# EAGLE design ButtonHack (EAGLE 9.4.2)
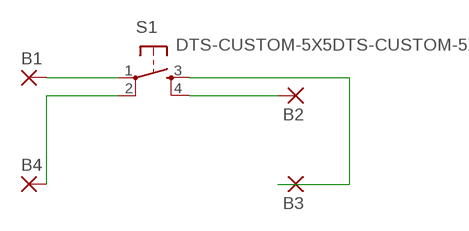
[diagram p0: schematic, sheet 1]

## Parts
B1  2,54/0,8  [2,54/0,8]
B2  2,54/0,8  [2,54/0,8]
B3  2,54/0,8  [2,54/0,8]
B4  2,54/0,8  [2,54/0,8]
S1  DTS-CUSTOM-5X5DTS-CUSTOM-5X5  [DTS-CUSTOM-5X5]

## Nets
N$1: B1.1(P) S1.1
N$2: B2.1(P) S1.4
N$3: B4.1(P) S1.2
N$4: B3.1(P) S1.3

## Library data of the parts
B1-B4 = wirepad:2,54/0,8: THROUGH-HOLE PAD
S1 = switch-tact:DTS-CUSTOM-5X5

## Net classes
0 default: width 0.762 mm, drill 0.762 mm, clearance 0.635 mm
1 Profile: width 0.254 mm, drill 0.254 mm, clearance 0.127 mm

## Board
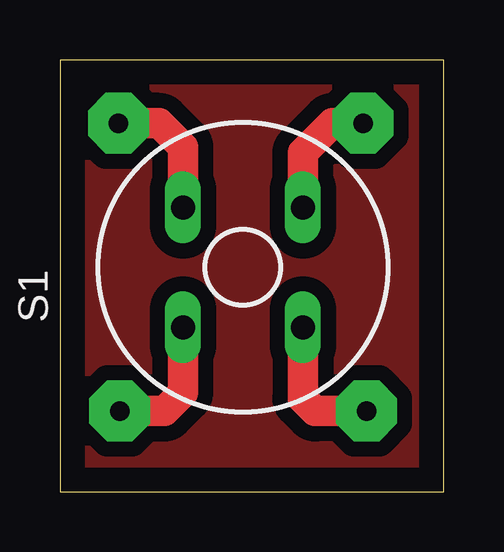
[diagram p1: board, top side]
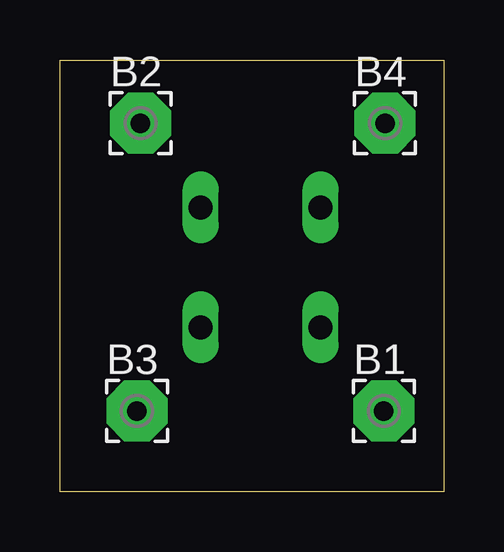
[diagram p2: board, bottom side, seen from below]

Size 16 x 18 mm. Coordinates in mm from the lower left corner, seen from the top.
Outline: 0,0 16,0 16,18 0,18 0,0
Copper layers (1*16): Top 0.035mm / dielectric 1.5mm / Bottom 0.035mm
Design rules "default": minimum track width 6mil, minimum drill 0.35mm, track to track 6mil, track to pad 6mil, pad to pad 6mil, via to via 6mil, smd to smd 6mil, copper to edge 40mil, drill to drill 6mil, minimum pad ring 10mil, minimum via ring 8mil, stop-mask expansion 4mil, vias tented up to drill 0mil, thermal gap 10mil

### Footprints (pad centres in the part's own frame; a part is rotated, then mirrored left to right if it is on the bottom)
2,54/0,8 = drill 0.813 pad 2.54 octagon: 1 0,0
DTS-CUSTOM-5X5 = drill 1 long: 1 -2.31,2.69; 2 2.69,2.69; 3 -2.31,-2.31; 4 2.69,-2.31

### Placement (x,y rotation side)
B1  2.49,3.36 0 bottom
B2  12.64,15.36 0 bottom
B3  12.79,3.36 0 bottom
B4  2.44,15.36 0 bottom
S1  7.82,9.16 90 top

### Tracks (layer width: path | path; a pad name or v marks a point on that pad's centre or on a via)
GND
  pour Top (isolate 0.325, rank 6): 0,18 16,18 16,0 0,0
N$1
  Top 1.27: S1.1 5.13,4.13 4.36,3.36 B1.1
N$2
  Top 1.27: S1.4 10.13,14.13 11.36,15.36 B2.1
N$3
  Top 1.27: S1.2 5.13,14.37 4.14,15.36 B4.1
N$4
  Top 1.27: S1.3 10.13,3.87 10.64,3.36 B3.1